# Altium schematic sheet 06_MCU.SchDoc: =TitleParameter
size A3; Organization: ASISGUARD; Address1: Kemalpasa, Kemalpasa Cd. No:290 D:292H, 35060 Bornova/Izmir/Turkey; SheetNumber: 6; SheetTotal: 12
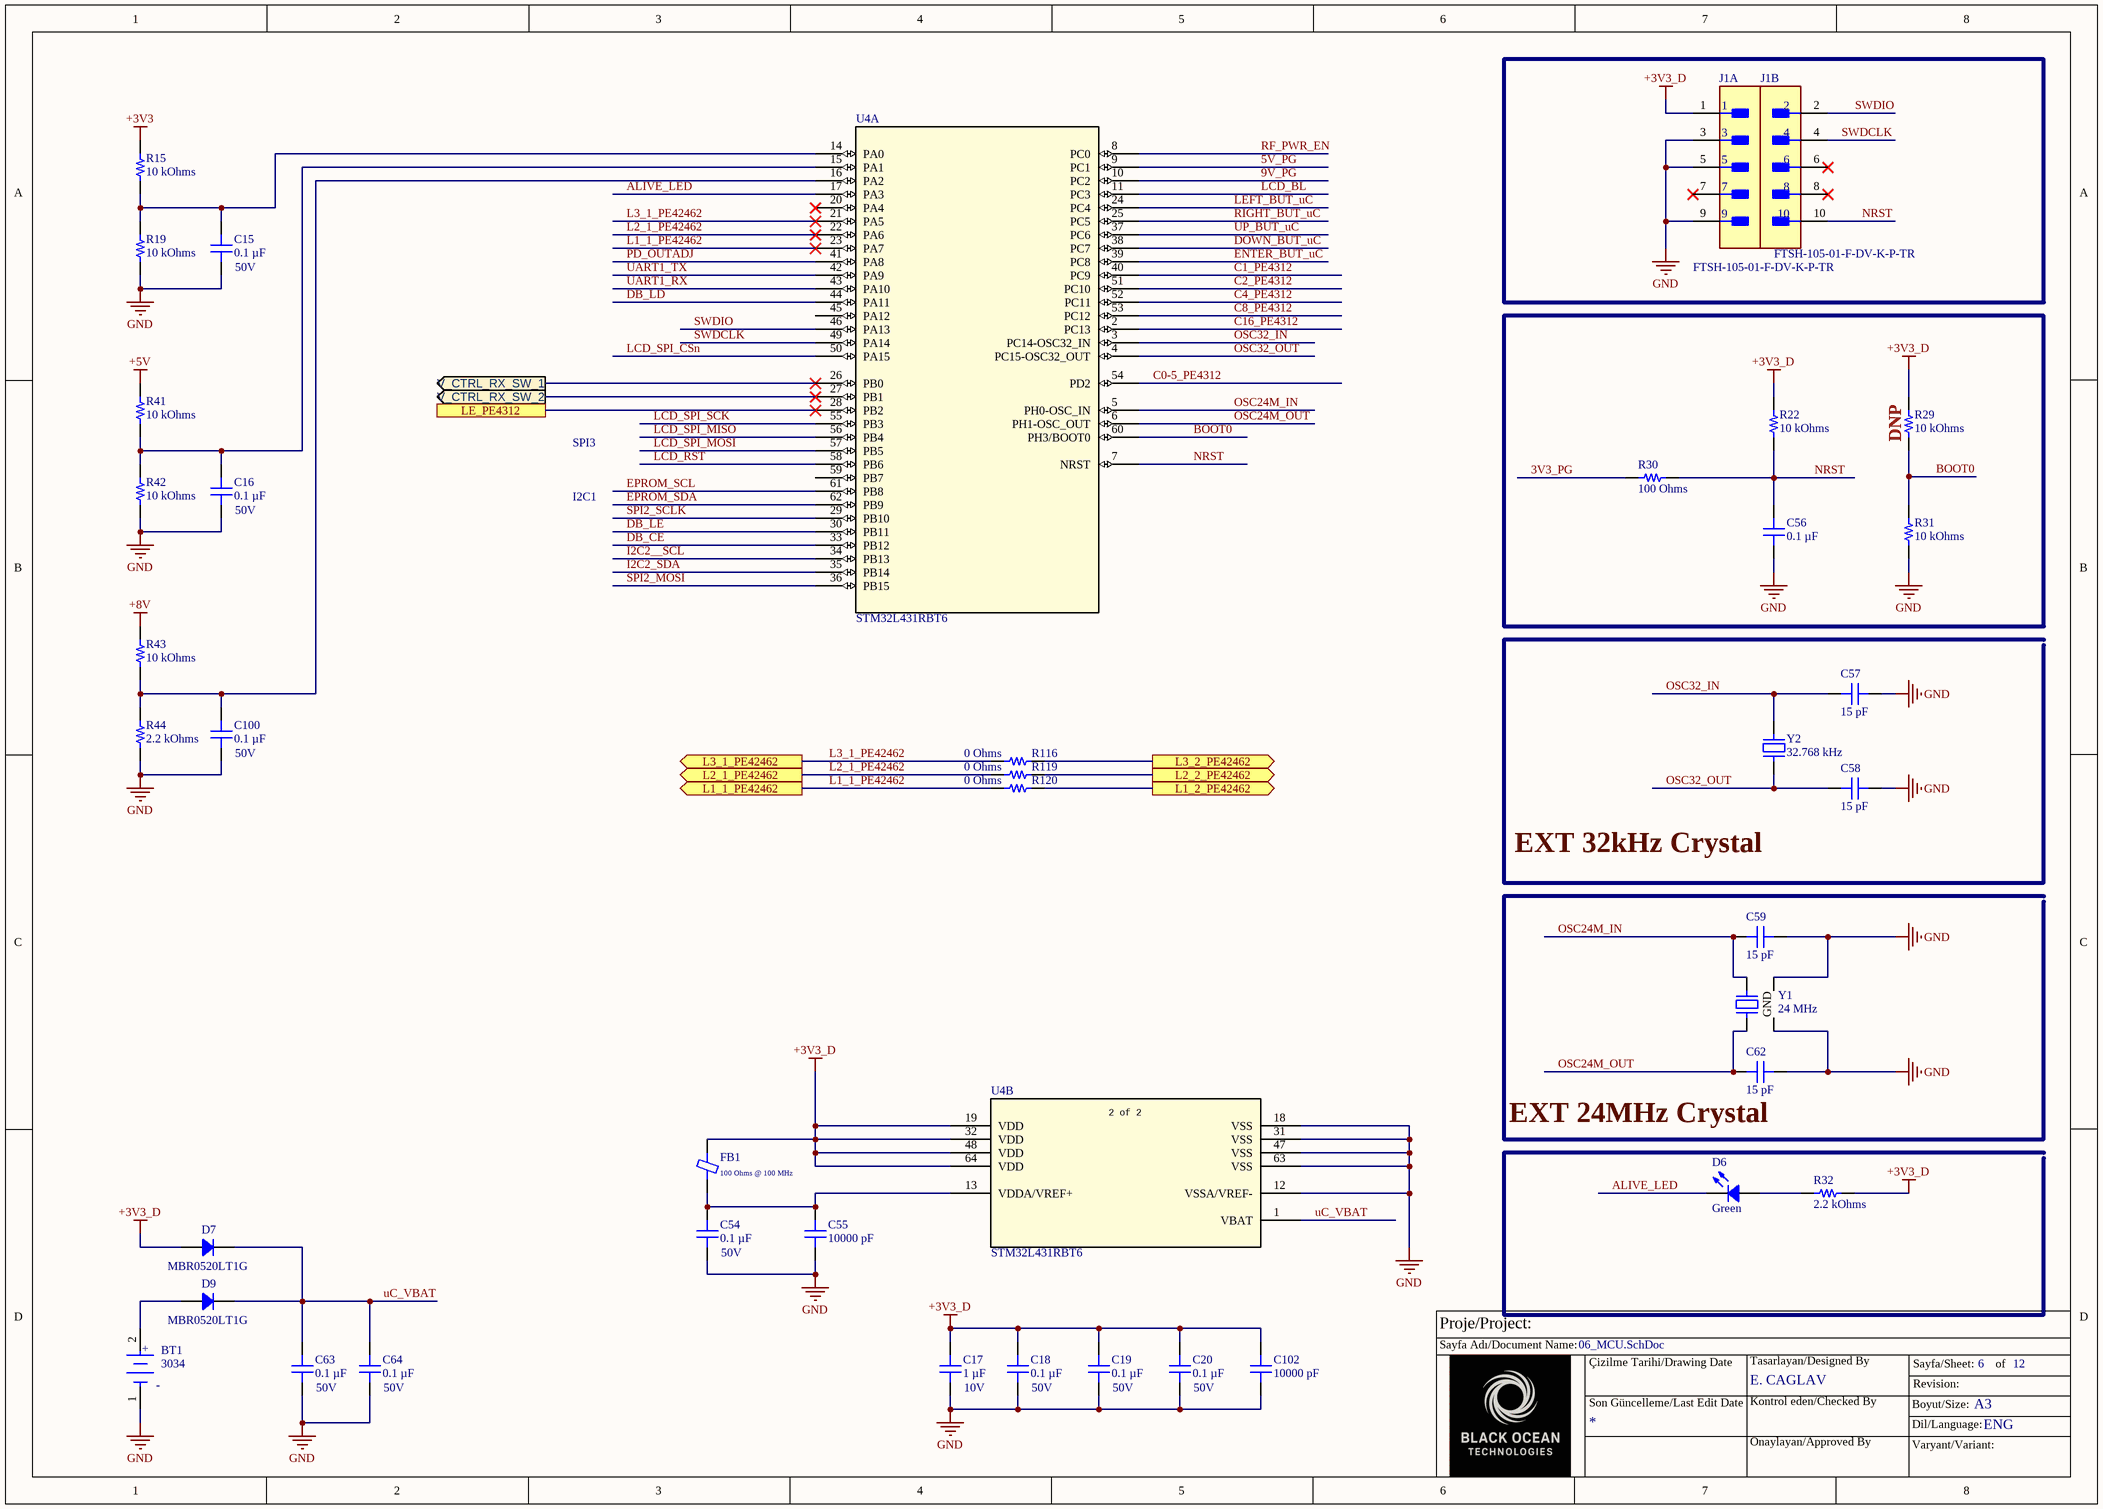
[diagram p0: 06_MCU.SchDoc]

## Parts
BT1  3034  [FP-3034-MFG]
C15  Voltage - Rated: 50V  [CAP 0402_1005]  (hidden comment: 0.1 µF)
C16  Voltage - Rated: 50V  [CAP 0402_1005]  (hidden comment: 0.1 µF)
C17  Voltage - Rated: 10V  [CAP 0402_1005]  (hidden comment: 1 µF)
C18  Voltage - Rated: 50V  [CAP 0402_1005]  (hidden comment: 0.1 µF)
C19  Voltage - Rated: 50V  [CAP 0402_1005]  (hidden comment: 0.1 µF)
C20  Voltage - Rated: 50V  [CAP 0402_1005]  (hidden comment: 0.1 µF)
C54  Voltage - Rated: 50V  [CAP 0402_1005]  (hidden comment: 0.1 µF)
C55  10000 pF  [CAP 0402_1005]
C56  0.1 µF  [CAP 0402_1005]
C57  15 pF  [CAP 0402_1005]
C58  15 pF  [CAP 0402_1005]
C59  15 pF  [CAP 0402_1005]
C62  15 pF  [CAP 0402_1005]
C63  Voltage - Rated: 50V  [CAP 0402_1005]  (hidden comment: 0.1 µF)
C64  Voltage - Rated: 50V  [CAP 0402_1005]  (hidden comment: 0.1 µF)
C100  Voltage - Rated: 50V  [CAP 0402_1005]  (hidden comment: 0.1 µF)
C102  10000 pF  [CAP 0402_1005]
D6  Green  [LED 0603_1608 GREEN]
D7  MBR0520LT1G  [SOD-123]
D9  MBR0520LT1G  [SOD-123]
FB1  100 Ohms @ 100 MHz  [FER 0603_1608]
J1  FTSH-105-01-F-DV-K-P-TR  [FP-FTSH-105-01-F-DV-K-P-T-MFG]  (parts A,B of 2)
R15  10 kOhms  [RES 0402_1005]
R19  10 kOhms  [RES 0402_1005]
R22  10 kOhms  [RES 0402_1005]
R29  10 kOhms  [RES 0402_1005]
R30  100 Ohms  [RES 0402_1005]
R31  10 kOhms  [RES 0402_1005]
R32  2.2 kOhms  [RES 0402_1005]
R41  10 kOhms  [RES 0402_1005]
R42  10 kOhms  [RES 0402_1005]
R43  10 kOhms  [RES 0402_1005]
R44  2.2 kOhms  [RES 0402_1005]
R116  0 Ohms  [RES 0402_1005]
R119  0 Ohms  [RES 0402_1005]
R120  0 Ohms  [RES 0402_1005]
U4  STM32L431RBT6  [LQFP-64]  (parts A,B of 2)
Y1  24 MHz  [EPSON TSX-3225]
Y2  32.768 kHz  [ABRACON ABS06]

## Blocks framed on the sheet
DNP: C56 R22 R29-R31

## Ports
L1_1_PE42462 (out), L1_2_PE42462 (out), L2_1_PE42462 (out), L2_2_PE42462 (out), L3_1_PE42462 (out), L3_2_PE42462 (out), LE_PE4312, V_CTRL_RX_SW_1 (out), V_CTRL_RX_SW_2 (out)

## Nets
+3V3: R15.2
+3V3_D: C17.1 C18.2 C19.2 C20.2 C102.2 D7.1 FB1.2 J1.1 R22.1 R29.1 R32.2 U4.19(VDD) U4.32(VDD) U4.48(VDD) U4.64(VDD)
+5V: R41.2
+8V: R43.2
GND: BT1.1(C) C15.1 C16.1 C17.2 C18.1 C19.1 C20.1 C54.1 C55.1 C56.1 C57.2 C58.2 C59.2 C62.2 C63.1 C64.1 C100.1 C102.1 J1.3 J1.5 J1.9 R19.1 R31.2 R42.1 R44.1 U4.12(VSSA/VREF-) U4.18(VSS) U4.31(VSS) U4.47(VSS) U4.63(VSS) Y1.2(GND) Y1.4(GND)
3V3_PG: R30.1
5V_PG: U4.9(PC1)
9V_PG: U4.10(PC2)
ALIVE_LED: D6.2 U4.17(PA3)
BOOT0: R29.2 R31.1 U4.60(PH3/BOOT0)
C0-5_PE4312: U4.54(PD2)
C1_PE4312: U4.40(PC9)
C2_PE4312: U4.51(PC10)
C4_PE4312: U4.52(PC11)
C8_PE4312: U4.53(PC12)
C16_PE4312: U4.2(PC13)
DB_CE: U4.33(PB12)
DB_LD: U4.44(PA11)
DB_LE: U4.30(PB11)
DOWN_BUT_uC: U4.38(PC7)
ENTER_BUT_uC: U4.39(PC8)
EPROM_SCL: U4.61(PB8)
EPROM_SDA: U4.62(PB9)
I2C2__SCL: U4.34(PB13)
I2C2_SDA: U4.35(PB14)
L1_1_PE42462: R120.1 U4.23(PA7) ; port L1_1_PE42462
L1_2_PE42462: R120.2 ; port L1_2_PE42462
L2_1_PE42462: R119.1 U4.22(PA6) ; port L2_1_PE42462
L2_2_PE42462: R119.2 ; port L2_2_PE42462
L3_1_PE42462: R116.1 U4.21(PA5) ; port L3_1_PE42462
L3_2_PE42462: R116.2 ; port L3_2_PE42462
LCD_BL: U4.11(PC3)
LCD_RST: U4.58(PB6)
LCD_SPI_CSn: U4.50(PA15)
LCD_SPI_MISO: U4.56(PB4)
LCD_SPI_MOSI: U4.57(PB5)
LCD_SPI_SCK: U4.55(PB3)
LE_PE4312: U4.28(PB2) ; port LE_PE4312
LEFT_BUT_uC: U4.24(PC4)
NRST: C56.2 J1.10 R22.2 R30.2 U4.7(NRST)
OSC24M_IN: C59.1 U4.5(PH0-OSC_IN) Y1.3
OSC24M_OUT: C62.1 U4.6(PH1-OSC_OUT) Y1.1
OSC32_IN: C57.1 U4.3(PC14-OSC32_IN) Y2.2
OSC32_OUT: C58.1 U4.4(PC15-OSC32_OUT) Y2.1
PD_OUTADJ: U4.41(PA8)
RF_PWR_EN: U4.8(PC0)
RIGHT_BUT_uC: U4.25(PC5)
SPI2_MOSI: U4.36(PB15)
SPI2_SCLK: U4.29(PB10)
SWDCLK: J1.4 U4.49(PA14)
SWDIO: J1.2 U4.46(PA13)
UART1_RX: U4.43(PA10)
UART1_TX: U4.42(PA9)
uC_VBAT: C63.2 C64.2 D7.2 D9.2 U4.1(VBAT)
UP_BUT_uC: U4.37(PC6)
V_CTRL_RX_SW_1: U4.26(PB0) ; port V_CTRL_RX_SW_1
V_CTRL_RX_SW_2: U4.27(PB1) ; port V_CTRL_RX_SW_2
NetBT1_2: BT1.2(A) D9.1
NetC15_2: C15.2 R15.1 R19.2 U4.14(PA0)
NetC16_2: C16.2 R41.1 R42.2 U4.15(PA1)
NetC54_2: C54.2 C55.2 FB1.1 U4.13(VDDA/VREF+)
NetC100_2: C100.2 R43.1 R44.2 U4.16(PA2)
NetD6_1: D6.1 R32.1

Not connected (* = marked no-connect by the designer): J1 6* 7* 8*; U4 20(PA4)* 45(PA12) 59(PB7)

## Notes on the sheet
- SPI3
- I2C1
- EXT 32kHz Crystal
- (near C62) EXT 24MHz Crystal
- Proje/Project:
- Sayfa Adı/Document Name:
- Çizilme Tarihi/Drawing Date
- E. CAGLAV
- Tasarlayan/Designed By
- Sayfa/Sheet:
- Revision:
- of
- Son Güncelleme/Last Edit Date
- Kontrol eden/Checked By
- Onaylayan/Approved By
- Boyut/Size:
- Varyant/Variant:
- Dil/Language:
- A3
- ENG
- (in symbol CMP-19636-000006-1) +; -
- (in symbol STM32L431RBT6, part B) 2 of 2

## Library data of the parts
BT1 = CMP-19636-000006-1: BATTERY RETAINER COIN 20MM SMD; Manufacturer: Keystone Electronics; Number Of Contacts: 2; Height: 4.31mm; Device Class L1: Connectors; Device Class L3: unset; RoHS: TRUE; Automotive: No; Mouser Description: Coin Cell Battery Holders COIN CELL RETAINER; Contact Material: Nickel; Digikey Description: BATTERY RETAINER COIN 20MM SMD; Category: Batt; Package: 3034; ComponentLink2URL: https://www.keyelco.com/product-pdf.cfm?p=798; Manufacturer Part Number: 3034; Octopart: https://octopart.com/3034-keystone-27554462; ComponentLink2Description: Datasheet; Device Class L2: unset; Lead Free: Yes
C15 C16 C18-C20 C54 C63 C64 C100 = GCM155R71H104KE02J: CAP CER 0.1UF 50V X7R 0402; manufacturer: Murata Electronics; Tolerance: ±10%; Part Number: GCM155R71H104KE02J; Capacitance: 0.1 µF; Applications: Automotive; componentlink1description: Datasheet; componentlink1url: https://search.murata.co.jp/Ceramy/image/img/A01X/G101/ENG/GCM155R71H104KE02-01.pdf; componentlink2description: DigiKey Link; componentlink2url: https://www.digikey.com/en/products/detail/murata-electronics/GCM155R71H104KE02J/4903705; Device Package: 0402 (1005 Metric); lastupdated: 4/6/2026 7:10:30 PM; Lifecycle Status: Active; Minimum Order: 1; Mounting Type: Surface Mount, MLCC; Operating Temperature: -55°C ~ 125°C; Package / Case: 0402 (1005 Metric); packaging: TapeAndReel; partid: 11356; Part Status: Active; price: 0.01; Ratings: AEC-Q200; series: GCM; Size / Dimension: 0.039" L x 0.020" W (1.00mm x 0.50mm); Supplier 1: DigiKey; Supplier Part Number 1: 490-14514-1-ND; Temperature Coefficient: X7R; Thickness (Max): 0.022" (0.55mm); value: 0.1 µF
C17 = GRM155C71A105KE11D: CAP CER 1UF 10V X7S 0402; manufacturer: Murata Electronics; Tolerance: ±10%; Part Number: GRM155C71A105KE11D; Capacitance: 1 µF; Applications: General Purpose; componentlink1description: Datasheet; componentlink1url: https://search.murata.co.jp/Ceramy/image/img/A01X/G101/ENG/GRM155C71A105KE11-01.pdf; componentlink2description: DigiKey Link; componentlink2url: https://www.digikey.com/en/products/detail/murata-electronics/GRM155C71A105KE11D/6606086; Device Package: 0402 (1005 Metric); lastupdated: 4/6/2026 7:11:12 PM; Lifecycle Status: Active; Minimum Order: 1; Mounting Type: Surface Mount, MLCC; Operating Temperature: -55°C ~ 125°C; Package / Case: 0402 (1005 Metric); packaging: TapeAndReel; partid: 1749; Part Status: Active; price: 0.01; series: GRM; Size / Dimension: 0.039" L x 0.020" W (1.00mm x 0.50mm); Supplier 1: DigiKey; Supplier Part Number 1: 490-14457-1-ND; Temperature Coefficient: X7S; Thickness (Max): 0.024" (0.60mm); value: 1 µF
C55 C102 = AC0402KPX7R9BB103: CAP CER 10000PF 50V X7R 0402; manufacturer: Yageo; Tolerance: ±10%; Part Number: AC0402KPX7R9BB103; Capacitance: 10000 pF; Applications: Automotive; componentlink1description: Datasheet; componentlink1url: http://www.yageo.com/documents/recent/UPY-AC_NP0X7R_16V-to-630V_12.pdf; componentlink2description: DigiKey Link; componentlink2url: https://www.digikey.com/en/products/detail/yageo/AC0402KPX7R9BB103/6643253; Device Package: 0402 (1005 Metric); lastupdated: 4/6/2026 7:11:07 PM; Lifecycle Status: Active; Minimum Order: 1; Mounting Type: Surface Mount, MLCC; Operating Temperature: -55°C ~ 125°C; Package / Case: 0402 (1005 Metric); packaging: CutTape; partid: 2384; Part Status: Active; price: 0.01; Ratings: AEC-Q200; series: AC; Size / Dimension: 0.039" L x 0.020" W (1.00mm x 0.50mm); Supplier 1: DigiKey; Supplier Part Number 1: 311-3267-1-ND; Temperature Coefficient: X7R; Thickness (Max): 0.022" (0.55mm); value: 10000 pF; Voltage - Rated: 50V
C56 = GRM155R71H104KE14J: CAP CER 0.1UF 50V X7R 0402; manufacturer: Murata Electronics; Tolerance: ±10%; Part Number: GRM155R71H104KE14J; Capacitance: 0.1 µF; Applications: General Purpose; componentlink1description: Datasheet; componentlink1url: https://search.murata.co.jp/Ceramy/image/img/A01X/G101/ENG/GRM155R71H104KE14-01.pdf; componentlink2description: DigiKey Link; componentlink2url: https://www.digikey.com/en/products/detail/murata-electronics/GRM155R71H104KE14J/4905180; Device Package: 0402 (1005 Metric); lastupdated: 4/6/2026 7:11:00 PM; Lifecycle Status: Active; Minimum Order: 1; Mounting Type: Surface Mount, MLCC; Operating Temperature: -55°C ~ 125°C; Package / Case: 0402 (1005 Metric); packaging: CutTape; partid: 4071; Part Status: Active; price: 0.01; series: GRM; Size / Dimension: 0.039" L x 0.020" W (1.00mm x 0.50mm); Supplier 1: DigiKey; Supplier Part Number 1: 490-13342-1-ND; Temperature Coefficient: X7R; Thickness (Max): 0.022" (0.55mm); value: 0.1 µF; Voltage - Rated: 50V
C57-C59 C62 = CC0402GRNPO9BN150: CAP CER 15PF 50V C0G/NPO 0402; manufacturer: Yageo; Temperature Coefficient: C0G, NP0; Tolerance: ±2%; Part Number: CC0402GRNPO9BN150; Capacitance: 15 pF; Applications: General Purpose; componentlink1description: Datasheet; componentlink1url: https://www.yageo.com/upload/media/product/productsearch/datasheet/mlcc/UPY-GP_NP0_16V-to-50V_17.pdf; componentlink2description: DigiKey Link; componentlink2url: https://www.digikey.com/en/products/detail/yageo/CC0402GRNPO9BN150/5195058; Device Package: 0402 (1005 Metric); lastupdated: 4/6/2026 7:11:11 PM; Lifecycle Status: Active; Minimum Order: 1; Mounting Type: Surface Mount, MLCC; Operating Temperature: -55°C ~ 125°C; Package / Case: 0402 (1005 Metric); packaging: TapeAndReel; partid: 1901; Part Status: Active; price: 0.01; series: CC; Size / Dimension: 0.039" L x 0.020" W (1.00mm x 0.50mm); Supplier 1: DigiKey; Supplier Part Number 1: 311-1649-1-ND; Thickness (Max): 0.022" (0.55mm); value: 15 pF; Voltage - Rated: 50V
D6 = TLMP1100-GS08: LED GREEN 0603 SMD; Manufacturer: Vishay Semiconductor Opto Division; Configuration: Standard; Current - Test: 20mA; Lens Color: 0.65mm; Lens Size: 1.60mm x 0.80mm; Lens Style: Rectangle with Flat Top; Millicandela Rating: 15mcd; Viewing Angle: 160°; Voltage - Forward (Vf) (Typ): 2.1V; Wavelength - Dominant: 561nm; Wavelength - Peak: 562nm; Part Number: TLMP1100-GS08; Color: Green; ComponentLink1Description: Datasheet; ComponentLink1URL: http://www.vishay.com/docs/83173/tlmb1100.pdf; ComponentLink2Description: DigiKey Link; ComponentLink2URL: https://www.digikey.com/en/products/detail/vishay-semiconductor-opto-division/TLMP1100-GS08/1681311; Device Package: 0603 (1608 Metric); Height (Max): 0.65mm; LastUpdated: 3/11/2024 7:51:09 AM; Lifecycle Status: Active; Minimum Order: 1; Mounting Type: Surface Mount; Package / Case: 0603 (1608 Metric); Packaging: TapeAndReel; PartId: 692; Part Status: Active; Price: 0.11; Series: Automotive, AEC-Q101; Size / Dimension: 1.60mm L x 0.80mm W; Supplier 1: DigiKey; Supplier Part Number 1: 751-1176-1-ND; Supplier Device Package: 0603; Value: Green
D7 D9 = MBR0520LT1G: DIODE SCHOTTKY 20V 500MA SOD123; Manufacturer: ON Semiconductor; Current - Reverse Leakage @ Vr: 250µA @ 20V; Speed: Fast Recovery =< 500ns, > 200mA (Io); Voltage - Forward (Vf) (Max) @ If: 385mV @ 500mA; Part Number: MBR0520LT1G; ComponentLink1Description: Datasheet; ComponentLink1URL: http://www.onsemi.com/pub/Collateral/MBR0520LT1-D.PDF; ComponentLink2Description: DigiKey Link; ComponentLink2URL: http://digikey.com/product-detail/en/on-semiconductor/MBR0520LT1G/MBR0520LT1GOSCT-ND/917965; Current - Average Rectified (Io): 500mA; Diode Type: Schottky; LastUpdated: 6/3/2024 7:54:46 PM; Lifecycle Status: Active; Minimum Order: 1; Mounting Type: Surface Mount; Operating Temperature - Junction: -65°C ~ 125°C; Package / Case: SOD-123; Packaging: TapeAndReel; PartId: 2222; Part Status: Active; Price: 0.05; Series: -; Supplier 1: DigiKey; Supplier Part Number 1: MBR0520LT1GOSCT-ND; Supplier Device Package: SOD-123; Voltage - DC Reverse (Vr) (Max): 20V
FB1 = MH1608-101Y: FERRITE BEAD 100 OHM 0603 1LN; Manufacturer: Bourns Inc.; Current Rating (Max): 3A; DC Resistance (DCR) (Max): 40mOhm; Filter Type: Power, Signal Line; Number of Lines: 1; Part Number: MH1608-101Y; ComponentLink1Description: Datasheet; ComponentLink1URL: https://www.bourns.com/docs/Product-Datasheets/mh.pdf; ComponentLink2Description: DigiKey Link; ComponentLink2URL: https://www.digikey.com/en/products/detail/bourns-inc/MH1608-101Y/2563310; Device Package: 0603 (1608 Metric); Height (Max): 0.039" (1.00mm); Impedance @ Frequency: 100 Ohms @ 100 MHz; LastUpdated: 5/9/2023 8:13:07 PM; Lifecycle Status: Active; Minimum Order: 1; Mounting Type: Surface Mount; Operating Temperature: -55°C ~ 125°C; Package / Case: 0603 (1608 Metric); Packaging: TapeAndReel; PartId: 645; Part Status: Active; Price: 0.02; Series: MH; Size / Dimension: 0.063" L x 0.032" W (1.60mm x 0.80mm); Supplier 1: DigiKey; Supplier Part Number 1: MH1608-101YCT-ND; Value: 100 Ohms @ 100 MHz
J1 = CMP-02766-000120-1: CONN HEADER SMD 10POS 1.27MM; Number of Contacts: 10; Row Spacing: 0.05inch; Connector Type: Male Pin; Contact Plating: Gold; Housing Material: Polymer; Length: 6.35mm; Number of Rows: 2; Min Operating Temperature: -55°C; Pitch: 1.27mm; Termination: Solder; Package Quantity: 500; Lead Free: Lead Free; Radiation Hardening: No; Number of Positions: 10; Orientation: Straight; Contact Material: Bronze; Packaging: Tape and Reel; Depth: 5.84mm; Contact Mating Length: 0.12inch; Housing Color: Black; Mount: Surface Mount; Color: Black; Max Operating Temperature: 125°C
R15 R19 R22 R29 R31 R41-R43 = RC0402FR-0710KL: RES 10K OHM 1% 1/16W 0402; Manufacturer: Yageo; Power (Watts): 0.063W, 1/16W; Temperature Coefficient: ±100ppm/°C; Part Number: RC0402FR-0710KL; Value: 10 kOhms; ComponentLink1Description: Datasheet; ComponentLink1URL: https://www.yageo.com/upload/media/product/productsearch/datasheet/rchip/PYu-RC_Group_51_RoHS_L_10.pdf; ComponentLink2Description: DigiKey Link; ComponentLink2URL: https://www.digikey.com/en/products/detail/yageo/RC0402FR-0710KL/726523; Composition: Thick Film; Device Package: 0402 (1005 Metric); Features: Moisture Resistant; Height - Seated (Max): 0.016" (0.40mm); Lifecycle Status: Active; Minimum Order: 1; Number of Terminations: 2; Operating Temperature: -55°C ~ 155°C; Package / Case: 0402 (1005 Metric); Packaging: CutTape; PartId: 17593; Part Status: Active; Price: 0.01; Resistance: 10 kOhms; Series: RC_L; Size / Dimension: 0.039" L x 0.020" W (1.00mm x 0.50mm); Supplier 1: DigiKey; Supplier Part Number 1: 311-10.0KLRCT-ND; Supplier Device Package: 0402; Tolerance: ±1%
  R15 R19 R41-R43: LastUpdated: 4/6/2026 7:41:07 PM
  R22 R29 R31: LastUpdated: 30.04.2023 19:24:29
R30 = RT0402FRE07100RL: RES SMD 100 OHM 1% 1/16W 0402; Manufacturer: Yageo; Power (Watts): 0.063W, 1/16W; Temperature Coefficient: ±50ppm/°C; Part Number: RT0402FRE07100RL; Value: 100 Ohms; ComponentLink1Description: Datasheet; ComponentLink1URL: https://www.yageo.com/upload/media/product/productsearch/datasheet/rchip/PYu-RT_1-to-0.01_RoHS_L_11.pdf; ComponentLink2Description: DigiKey Link; ComponentLink2URL: https://www.digikey.com/en/products/detail/yageo/RT0402FRE07100RL/1071699; Composition: Thin Film; Device Package: 0402 (1005 Metric); Height - Seated (Max): 0.014" (0.35mm); LastUpdated: 4/6/2026 7:41:17 PM; Lifecycle Status: Active; Minimum Order: 1; Number of Terminations: 2; Operating Temperature: -55°C ~ 155°C; Package / Case: 0402 (1005 Metric); Packaging: TapeAndReel; PartId: 3193; Part Status: Active; Price: 0.01; Resistance: 100 Ohms; Series: RT; Size / Dimension: 0.039" L x 0.020" W (1.00mm x 0.50mm); Supplier 1: DigiKey; Supplier Part Number 1: YAG3342CT-ND; Supplier Device Package: 0402; Tolerance: ±1%
R32 R44 = RMCF0402FT2K20: RES 2.2K OHM 1% 1/16W 0402; Manufacturer: Stackpole Electronics Inc; Power (Watts): 0.063W, 1/16W; Temperature Coefficient: ±100ppm/°C; Part Number: RMCF0402FT2K20; Value: 2.2 kOhms; ComponentLink1Description: Datasheet; ComponentLink1URL: https://www.seielect.com/catalog/sei-rmcf_rmcp.pdf; ComponentLink2Description: DigiKey Link; ComponentLink2URL: https://www.digikey.com/en/products/detail/stackpole-electronics-inc/RMCF0402FT2K20/2417439; Composition: Thick Film; Device Package: 0402 (1005 Metric); Features: Automotive AEC-Q200; Height - Seated (Max): 0.016" (0.40mm); LastUpdated: 2/9/2024 8:30:13 PM; Lifecycle Status: Active; Minimum Order: 1; Number of Terminations: 2; Operating Temperature: -55°C ~ 155°C; Package / Case: 0402 (1005 Metric); Packaging: CutTape; PartId: 4919; Part Status: Active; Price: 0.01; Ratings: AEC-Q200; Resistance: 2.2 kOhms; Series: RMCF; Size / Dimension: 0.039" L x 0.020" W (1.00mm x 0.50mm); Supplier 1: DigiKey; Supplier Part Number 1: RMCF0402FT2K20CT-ND; Supplier Device Package: 0402; Tolerance: ±1%
R116 R119 R120 = AC0402JR-070RL: RES SMD 0 OHM JUMPER 1/16W 0402; Manufacturer: Yageo; Power (Watts): 0.063W, 1/16W; Part Number: AC0402JR-070RL; Value: 0 Ohms; ComponentLink1Description: Datasheet; ComponentLink1URL: https://www.yageo.com/upload/media/product/productsearch/datasheet/rchip/PYu-AC_51_RoHS_L_7.pdf; ComponentLink2Description: DigiKey Link; ComponentLink2URL: https://www.digikey.com/en/products/detail/yageo/AC0402JR-070RL/2827807; Composition: Thick Film; Device Package: 0402 (1005 Metric); Features: Automotive AEC-Q200, Moisture Resistant; Height - Seated (Max): 0.015" (0.37mm); LastUpdated: 4/6/2026 7:41:03 PM; Lifecycle Status: Active; Minimum Order: 1; Number of Terminations: 2; Operating Temperature: -55°C ~ 155°C; Package / Case: 0402 (1005 Metric); Packaging: CutTape; PartId: 20617; Part Status: Active; Price: 0.01; Ratings: AEC-Q200; Resistance: 0 Ohms; Series: AC; Size / Dimension: 0.039" L x 0.020" W (1.00mm x 0.50mm); Supplier 1: DigiKey; Supplier Part Number 1: 311-0.0LBCT-ND; Supplier Device Package: 0402; Tolerance: Jumper
U4 = STM32L431RBT6: Ultra-low-power with FPU Arm Cortex-M4 MCU 80 MHz with 128 Kbytes of Flash memory; Manufacturer_Name: STMicroelectronics; Copyright: Copyright (C) 2026 Ultra Librarian. All rights reserved.; Manufacturer_Part_Number: STM32L431RBT6; RefDes: RefDes; Type: Type; Supplier 1: Farnell; Supplier Part Number 1: STM32L431RBT6; MAnufacturer Part Number: STM32L431RBT6
Y1 = TSX-3225 24.0000MF20G-AC3: CRYSTAL 24.0000MHZ 9PF SMD; Manufacturer: EPSON; ESR (Equivalent Series Resistance): 40 Ohms; Frequency Stability: ±20ppm; Frequency Tolerance: ±10ppm; Operating Mode: Fundamental; Part Number: TSX-3225 24.0000MF20G-AC3; ComponentLink1Description: Datasheet; ComponentLink1URL: https://support.epson.biz/td/api/doc_check.php?dl=brief_TSX-3225&lang=en; ComponentLink2Description: DigiKey Link; ComponentLink2URL: https://www.digikey.com/en/products/detail/epson/TSX-3225-24-0000MF20G-AC3/1825443; Frequency: 24 MHz; Height - Seated (Max): 0.024" (0.60mm); LastUpdated: 6/3/2024 8:02:15 PM; Lifecycle Status: Active; Load Capacitance: 9pF; Minimum Order: 1; Mounting Type: Surface Mount; Operating Temperature: -40°C ~ 105°C; Package / Case: 4-SMD, No Lead; Packaging: TapeAndReel; PartId: 440; Part Status: Active; Price: 0.40; Series: TSX-3225; Size / Dimension: 0.126" L x 0.098" W (3.20mm x 2.50mm); Supplier 1: DigiKey; Supplier Part Number 1: SER3634CT-ND; Type: MHz Crystal; Value: 24 MHz
Y2 = ABS06-32.768KHZ-9-T: CRYSTAL 32.7680KHZ 9PF SMD; Manufacturer: Abracon LLC; ESR (Equivalent Series Resistance): 90 kOhms; Frequency Tolerance: ±20ppm; Operating Mode: Fundamental; Part Number: ABS06-32.768KHZ-9-T; ComponentLink1Description: Datasheet; ComponentLink1URL: https://abracon.com/Resonators/ABS06.pdf; ComponentLink2Description: DigiKey Link; ComponentLink2URL: https://www.digikey.com/en/products/detail/abracon-llc/ABS06-32-768KHZ-9-T/2217992; Frequency: 32.768 kHz; Height - Seated (Max): 0.024" (0.60mm); LastUpdated: 4/5/2026 8:41:05 PM; Lifecycle Status: Active; Load Capacitance: 9pF; Minimum Order: 1; Mounting Type: Surface Mount; Operating Temperature: -40°C ~ 85°C; Package / Case: 2-SMD, No Lead; Packaging: TapeAndReel; PartId: 376; Part Status: Active; Price: 0.39; Series: ABS06; Size / Dimension: 0.079" L x 0.047" W (2.00mm x 1.20mm); Supplier 1: DigiKey; Supplier Part Number 1: 535-10246-1-ND; Type: kHz Crystal (Tuning Fork); Value: 32.768 kHz